# Altium project FIT_PM12.PrjPcb (part 10 of 13)

## Sheet XC2C128.SchDoc: FIT_PM12 board
size 420 x 297 mm; CheckedBy: G.Kasprowicz; Author: INR Moscow; CompanyName: WUT ISE; DrawnBy: M.Podgórski; Organization: WUT ISE; Address1: PW ISE; Address2: Nowowiejska 15/19 00-665 Warsaw; Address3: gkasprow@gmail.com; DocumentNumber: 7; Revision: 2; SheetNumber: 10; SheetTotal: 34; ModifiedBy: -; CheckedDate: -; Title2: CPLD; DivGrp: WUT ISE; Designer: INR RAS; ModifiedDate: -; ProjectName: Sensor Box
Used 12 times, as channels AFE/CPLD1, AFE/CPLD2, AFE/CPLD3, AFE/CPLD4, AFE/CPLD5, AFE/CPLD6, AFE/CPLD7, AFE/CPLD8, AFE/CPLD9, AFE/CPLD10, AFE/CPLD11, AFE/CPLD12. Parts and nets are listed once, with the designators drawn on the sheet.
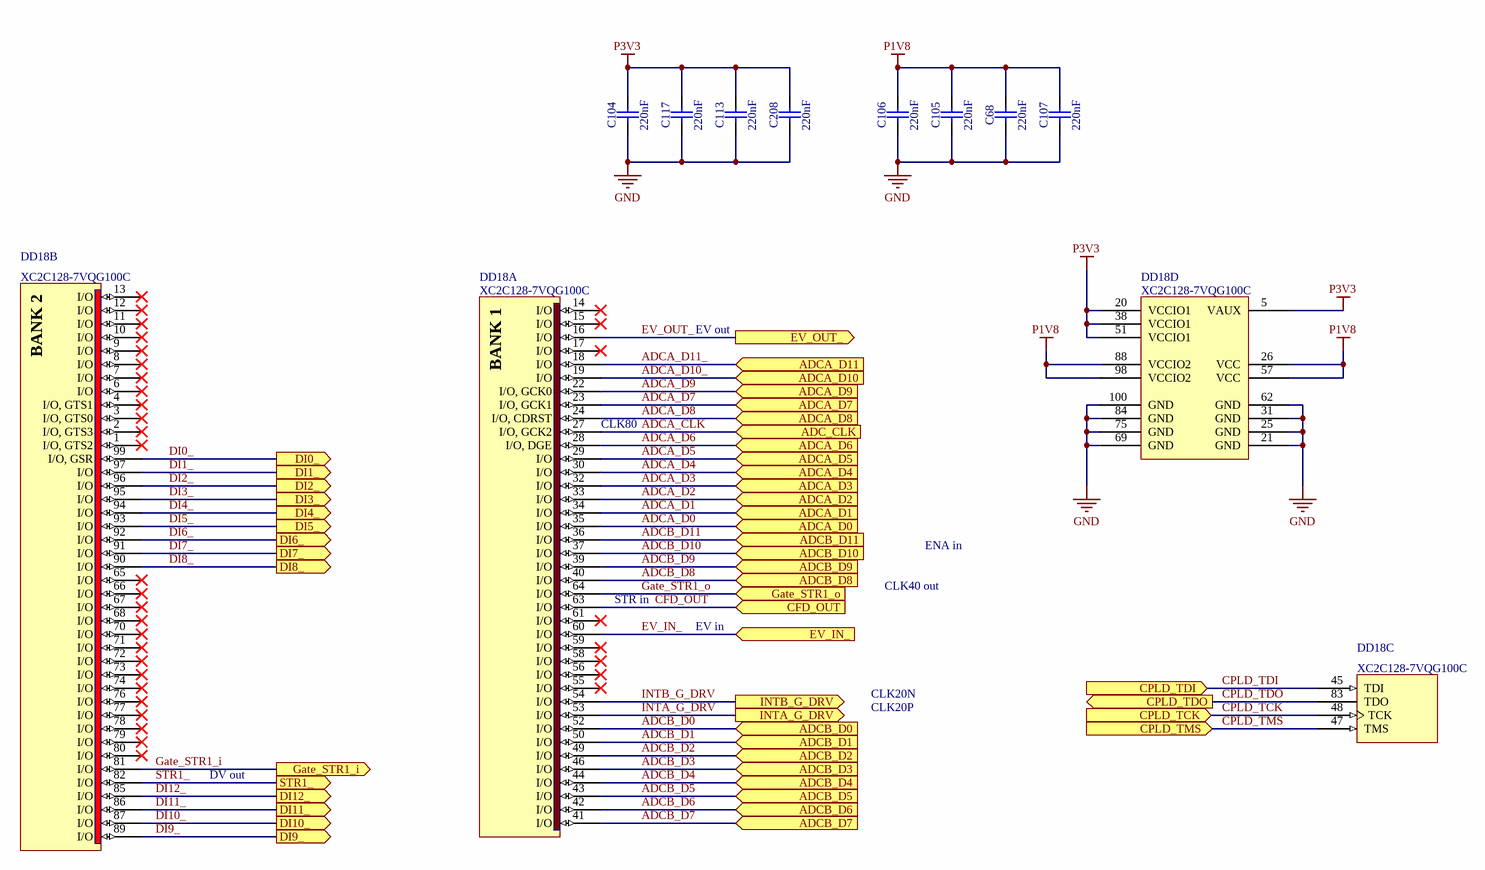
[diagram p30: XC2C128.SchDoc]

### Parts
C68  220nF  [CAPC2012X135N]
C104  220nF  [CAPC2012X135N]
C105  220nF  [CAPC2012X135N]
C106  220nF  [CAPC2012X135N]
C107  220nF  [CAPC2012X135N]
C113  220nF  [CAPC2012X135N]
C117  220nF  [CAPC2012X135N]
C208  220nF  [CAPC2012X135N]
DD18  XC2C128-7VQG100C  [QFP50P1600X1600X120-100N]  (parts A,B,C,D of 4)

### Ports
ADC_CLK (in), ADCA_D0 (in), ADCA_D1 (in), ADCA_D2 (in), ADCA_D3 (in), ADCA_D4 (in), ADCA_D5 (in), ADCA_D6 (in), ADCA_D7 (in), ADCA_D8 (in), ADCA_D9 (in), ADCA_D10 (in), ADCA_D11 (in), ADCB_D0 (in), ADCB_D1 (in), ADCB_D2 (in), ADCB_D3 (in), ADCB_D4 (in), ADCB_D5 (in), ADCB_D6 (in), ADCB_D7 (in), ADCB_D8 (in), ADCB_D9 (in), ADCB_D10 (in), ADCB_D11 (in), CFD_OUT (in), CPLD_TCK (in), CPLD_TDI (in), CPLD_TDO (out), CPLD_TMS (in), DI0_ (out), DI1_ (out), DI2_ (out), DI3_ (out), DI4_ (out), DI5_ (out), DI6_ (out), DI7_ (out), DI8_ (out), DI9_ (out), DI10_ (out), DI11_ (out), DI12_ (out), EV_IN_ (in), EV_OUT_ (out), Gate_STR1_i (out), Gate_STR1_o (in), INTA_G_DRV (out), INTB_G_DRV (out), STR1_ (out)

### Nets
GND: C68.1 C104.1 C105.1 C106.1 C107.1 C113.1 C117.1 C208.1 DD18.21(GND) DD18.25(GND) DD18.31(GND) DD18.62(GND) DD18.69(GND) DD18.75(GND) DD18.84(GND) DD18.100(GND)
P1V8: C68.2 C105.2 C106.2 C107.2 DD18.26(VCC) DD18.57(VCC) DD18.88(VCCIO2) DD18.98(VCCIO2)
P3V3: C104.2 C113.2 C117.2 C208.2 DD18.5(VAUX) DD18.20(VCCIO1) DD18.38(VCCIO1) DD18.51(VCCIO1)
ADCA_CLK: DD18.27(I/O,_GCK2) ; port ADC_CLK
ADCA_D0: DD18.35(I/O) ; port ADCA_D0
ADCA_D1: DD18.34(I/O) ; port ADCA_D1
ADCA_D2: DD18.33(I/O) ; port ADCA_D2
ADCA_D3: DD18.32(I/O) ; port ADCA_D3
ADCA_D4: DD18.30(I/O) ; port ADCA_D4
ADCA_D5: DD18.29(I/O) ; port ADCA_D5
ADCA_D6: DD18.28(I/O,_DGE) ; port ADCA_D6
ADCA_D7: DD18.23(I/O,_GCK1) ; port ADCA_D7
ADCA_D8: DD18.24(I/O,_CDRST) ; port ADCA_D8
ADCA_D9: DD18.22(I/O,_GCK0) ; port ADCA_D9
ADCA_D10_: DD18.19(I/O) ; port ADCA_D10
ADCA_D11_: DD18.18(I/O) ; port ADCA_D11
ADCB_D0: DD18.52(I/O) ; port ADCB_D0
ADCB_D1: DD18.50(I/O) ; port ADCB_D1
ADCB_D2: DD18.49(I/O) ; port ADCB_D2
ADCB_D3: DD18.46(I/O) ; port ADCB_D3
ADCB_D4: DD18.44(I/O) ; port ADCB_D4
ADCB_D5: DD18.43(I/O) ; port ADCB_D5
ADCB_D6: DD18.42(I/O) ; port ADCB_D6
ADCB_D7: DD18.41(I/O) ; port ADCB_D7
ADCB_D8: DD18.40(I/O) ; port ADCB_D8
ADCB_D9: DD18.39(I/O) ; port ADCB_D9
ADCB_D10: DD18.37(I/O) ; port ADCB_D10
ADCB_D11: DD18.36(I/O) ; port ADCB_D11
CFD_OUT: DD18.63(I/O) ; port CFD_OUT
CPLD_TCK: DD18.48(TCK) ; port CPLD_TCK
CPLD_TDI: DD18.45(TDI) ; port CPLD_TDI
CPLD_TDO: DD18.83(TDO) ; port CPLD_TDO
CPLD_TMS: DD18.47(TMS) ; port CPLD_TMS
DI0_: DD18.99(I/O,_GSR) ; port DI0_
DI1_: DD18.97(I/O) ; port DI1_
DI2_: DD18.96(I/O) ; port DI2_
DI3_: DD18.95(I/O) ; port DI3_
DI4_: DD18.94(I/O) ; port DI4_
DI5_: DD18.93(I/O) ; port DI5_
DI6_: DD18.92(I/O) ; port DI6_
DI7_: DD18.91(I/O) ; port DI7_
DI8_: DD18.90(I/O) ; port DI8_
DI9_: DD18.89(I/O) ; port DI9_
DI10_: DD18.87(I/O) ; port DI10_
DI11_: DD18.86(I/O) ; port DI11_
DI12_: DD18.85(I/O) ; port DI12_
EV_IN_: DD18.60(I/O) ; port EV_IN_
EV_OUT_: DD18.16(I/O) ; port EV_OUT_
Gate_STR1_i: DD18.81(I/O) ; port Gate_STR1_i
Gate_STR1_o: DD18.64(I/O) ; port Gate_STR1_o
INTA_G_DRV: DD18.53(I/O) ; port INTA_G_DRV
INTB_G_DRV: DD18.54(I/O) ; port INTB_G_DRV
STR1_: DD18.82(I/O) ; port STR1_

Not connected (* = marked no-connect by the designer): DD18 1(I/O,_GTS2)* 2(I/O,_GTS3)* 3(I/O,_GTS0)* 4(I/O,_GTS1)* 6(I/O)* 7(I/O)* 8(I/O)* 9(I/O)* 10(I/O)* 11(I/O)* 12(I/O)* 13(I/O)* 14(I/O)* 15(I/O)* 17(I/O)* 55(I/O)* 56(I/O)* 58(I/O)* 59(I/O)* 61(I/O)* 65(I/O)* 66(I/O)* 67(I/O)* 68(I/O)* 70(I/O)* 71(I/O)* 72(I/O)* 73(I/O)* 74(I/O)* 76(I/O)* 77(I/O)* 78(I/O)* 79(I/O)* 80(I/O)*

### Channels
AFE/CPLD1: designators end in A; ports ADC_CLK=ADC_CLK ADCA_D0=ADCA_D0 ADCA_D1=ADCA_D1 ADCA_D2=ADCA_D2 ADCA_D3=ADCA_D3 ADCA_D4=ADCA_D4 ADCA_D5=ADCA_D5 ADCA_D6=ADCA_D6 ADCA_D7=ADCA_D7 ADCA_D8=ADCA_D8 ADCA_D9=ADCA_D9 ADCA_D10=ADCA_D10_ ADCA_D11=ADCA_D11_ ADCB_D0=ADCB_D0 ADCB_D1=ADCB_D1 ADCB_D2=ADCB_D2 ADCB_D3=ADCB_D3 ADCB_D4=ADCB_D4 ADCB_D5=ADCB_D5 ADCB_D6=ADCB_D6 ADCB_D7=ADCB_D7 ADCB_D8=ADCB_D8 ADCB_D9=ADCB_D9 ADCB_D10=ADCB_D10 ADCB_D11=ADCB_D11 CFD_OUT=CFD_OUT CPLD_TCK=CPLD_TCK CPLD_TDI=CPLD_TDI CPLD_TDO=CPLD_TDI CPLD_TMS=CPLD_TMS DI0_=DI0_ DI1_=DI1_ DI2_=DI2_ DI3_=DI3_ DI4_=DI4_ DI5_=DI5_ DI6_=DI6_ DI7_=DI7_ DI8_=DI8_ DI9_=DI9_ DI10_=DI10_ DI11_=DI11_ DI12_=DI12_ EV_IN_=EV_IN_ EV_OUT_=EV_OUT__CPLD1 Gate_STR1_i=Gate_STR1_i Gate_STR1_o=Gate_STR1_o INTA_G_DRV=INTA_G_DRV INTB_G_DRV=INTB_G_DRV STR1_=STR1_
AFE/CPLD2: designators end in B; ports ADC_CLK=ADC_CLK ADCA_D0=ADCA_D0 ADCA_D1=ADCA_D1 ADCA_D2=ADCA_D2 ADCA_D3=ADCA_D3 ADCA_D4=ADCA_D4 ADCA_D5=ADCA_D5 ADCA_D6=ADCA_D6 ADCA_D7=ADCA_D7 ADCA_D8=ADCA_D8 ADCA_D9=ADCA_D9 ADCA_D10=ADCA_D10_ ADCA_D11=ADCA_D11_ ADCB_D0=ADCB_D0 ADCB_D1=ADCB_D1 ADCB_D2=ADCB_D2 ADCB_D3=ADCB_D3 ADCB_D4=ADCB_D4 ADCB_D5=ADCB_D5 ADCB_D6=ADCB_D6 ADCB_D7=ADCB_D7 ADCB_D8=ADCB_D8 ADCB_D9=ADCB_D9 ADCB_D10=ADCB_D10 ADCB_D11=ADCB_D11 CFD_OUT=CFD_OUT CPLD_TCK=CPLD_TCK CPLD_TDI=CPLD_TDI CPLD_TDO=CPLD_TDI CPLD_TMS=CPLD_TMS DI0_=DI0_ DI1_=DI1_ DI2_=DI2_ DI3_=DI3_ DI4_=DI4_ DI5_=DI5_ DI6_=DI6_ DI7_=DI7_ DI8_=DI8_ DI9_=DI9_ DI10_=DI10_ DI11_=DI11_ DI12_=DI12_ EV_IN_=EV_IN_ EV_OUT_=EV_IN_ Gate_STR1_i=Gate_STR1_i Gate_STR1_o=Gate_STR1_o INTA_G_DRV=INTA_G_DRV INTB_G_DRV=INTB_G_DRV STR1_=STR1_
AFE/CPLD3: designators end in C; ports ADC_CLK=ADC_CLK ADCA_D0=ADCA_D0 ADCA_D1=ADCA_D1 ADCA_D2=ADCA_D2 ADCA_D3=ADCA_D3 ADCA_D4=ADCA_D4 ADCA_D5=ADCA_D5 ADCA_D6=ADCA_D6 ADCA_D7=ADCA_D7 ADCA_D8=ADCA_D8 ADCA_D9=ADCA_D9 ADCA_D10=ADCA_D10_ ADCA_D11=ADCA_D11_ ADCB_D0=ADCB_D0 ADCB_D1=ADCB_D1 ADCB_D2=ADCB_D2 ADCB_D3=ADCB_D3 ADCB_D4=ADCB_D4 ADCB_D5=ADCB_D5 ADCB_D6=ADCB_D6 ADCB_D7=ADCB_D7 ADCB_D8=ADCB_D8 ADCB_D9=ADCB_D9 ADCB_D10=ADCB_D10 ADCB_D11=ADCB_D11 CFD_OUT=CFD_OUT CPLD_TCK=CPLD_TCK CPLD_TDI=CPLD_TDI CPLD_TDO=CPLD_TDI CPLD_TMS=CPLD_TMS DI0_=DI0_ DI1_=DI1_ DI2_=DI2_ DI3_=DI3_ DI4_=DI4_ DI5_=DI5_ DI6_=DI6_ DI7_=DI7_ DI8_=DI8_ DI9_=DI9_ DI10_=DI10_ DI11_=DI11_ DI12_=DI12_ EV_IN_=EV_IN_ EV_OUT_=EV_IN_ Gate_STR1_i=Gate_STR1_i Gate_STR1_o=Gate_STR1_o INTA_G_DRV=INTA_G_DRV INTB_G_DRV=INTB_G_DRV STR1_=STR1_
AFE/CPLD4: designators end in D; ports ADC_CLK=ADC_CLK ADCA_D0=ADCA_D0 ADCA_D1=ADCA_D1 ADCA_D2=ADCA_D2 ADCA_D3=ADCA_D3 ADCA_D4=ADCA_D4 ADCA_D5=ADCA_D5 ADCA_D6=ADCA_D6 ADCA_D7=ADCA_D7 ADCA_D8=ADCA_D8 ADCA_D9=ADCA_D9 ADCA_D10=ADCA_D10_ ADCA_D11=ADCA_D11_ ADCB_D0=ADCB_D0 ADCB_D1=ADCB_D1 ADCB_D2=ADCB_D2 ADCB_D3=ADCB_D3 ADCB_D4=ADCB_D4 ADCB_D5=ADCB_D5 ADCB_D6=ADCB_D6 ADCB_D7=ADCB_D7 ADCB_D8=ADCB_D8 ADCB_D9=ADCB_D9 ADCB_D10=ADCB_D10 ADCB_D11=ADCB_D11 CFD_OUT=CFD_OUT CPLD_TCK=CPLD_TCK CPLD_TDI=CPLD_TDI CPLD_TDO=CPLD_TDI CPLD_TMS=CPLD_TMS DI0_=DI0_ DI1_=DI1_ DI2_=DI2_ DI3_=DI3_ DI4_=DI4_ DI5_=DI5_ DI6_=DI6_ DI7_=DI7_ DI8_=DI8_ DI9_=DI9_ DI10_=DI10_ DI11_=DI11_ DI12_=DI12_ EV_IN_=EV_IN_ EV_OUT_=EV_IN_ Gate_STR1_i=Gate_STR1_i Gate_STR1_o=Gate_STR1_o INTA_G_DRV=INTA_G_DRV INTB_G_DRV=INTB_G_DRV STR1_=STR1_
AFE/CPLD5: designators end in E; ports ADC_CLK=ADC_CLK ADCA_D0=ADCA_D0 ADCA_D1=ADCA_D1 ADCA_D2=ADCA_D2 ADCA_D3=ADCA_D3 ADCA_D4=ADCA_D4 ADCA_D5=ADCA_D5 ADCA_D6=ADCA_D6 ADCA_D7=ADCA_D7 ADCA_D8=ADCA_D8 ADCA_D9=ADCA_D9 ADCA_D10=ADCA_D10_ ADCA_D11=ADCA_D11_ ADCB_D0=ADCB_D0 ADCB_D1=ADCB_D1 ADCB_D2=ADCB_D2 ADCB_D3=ADCB_D3 ADCB_D4=ADCB_D4 ADCB_D5=ADCB_D5 ADCB_D6=ADCB_D6 ADCB_D7=ADCB_D7 ADCB_D8=ADCB_D8 ADCB_D9=ADCB_D9 ADCB_D10=ADCB_D10 ADCB_D11=ADCB_D11 CFD_OUT=CFD_OUT CPLD_TCK=CPLD_TCK CPLD_TDI=CPLD_TDI CPLD_TDO=CPLD_TDI CPLD_TMS=CPLD_TMS DI0_=DI0_ DI1_=DI1_ DI2_=DI2_ DI3_=DI3_ DI4_=DI4_ DI5_=DI5_ DI6_=DI6_ DI7_=DI7_ DI8_=DI8_ DI9_=DI9_ DI10_=DI10_ DI11_=DI11_ DI12_=DI12_ EV_IN_=EV_IN_ EV_OUT_=EV_IN_ Gate_STR1_i=Gate_STR1_i Gate_STR1_o=Gate_STR1_o INTA_G_DRV=INTA_G_DRV INTB_G_DRV=INTB_G_DRV STR1_=STR1_
AFE/CPLD6: designators end in F; ports ADC_CLK=ADC_CLK ADCA_D0=ADCA_D0 ADCA_D1=ADCA_D1 ADCA_D2=ADCA_D2 ADCA_D3=ADCA_D3 ADCA_D4=ADCA_D4 ADCA_D5=ADCA_D5 ADCA_D6=ADCA_D6 ADCA_D7=ADCA_D7 ADCA_D8=ADCA_D8 ADCA_D9=ADCA_D9 ADCA_D10=ADCA_D10_ ADCA_D11=ADCA_D11_ ADCB_D0=ADCB_D0 ADCB_D1=ADCB_D1 ADCB_D2=ADCB_D2 ADCB_D3=ADCB_D3 ADCB_D4=ADCB_D4 ADCB_D5=ADCB_D5 ADCB_D6=ADCB_D6 ADCB_D7=ADCB_D7 ADCB_D8=ADCB_D8 ADCB_D9=ADCB_D9 ADCB_D10=ADCB_D10 ADCB_D11=ADCB_D11 CFD_OUT=CFD_OUT CPLD_TCK=CPLD_TCK CPLD_TDI=CPLD_TDI CPLD_TDO=CPLD_TDI CPLD_TMS=CPLD_TMS DI0_=DI0_ DI1_=DI1_ DI2_=DI2_ DI3_=DI3_ DI4_=DI4_ DI5_=DI5_ DI6_=DI6_ DI7_=DI7_ DI8_=DI8_ DI9_=DI9_ DI10_=DI10_ DI11_=DI11_ DI12_=DI12_ EV_IN_=EV_IN_ EV_OUT_=EV_IN_ Gate_STR1_i=Gate_STR1_i Gate_STR1_o=Gate_STR1_o INTA_G_DRV=INTA_G_DRV INTB_G_DRV=INTB_G_DRV STR1_=STR1_
AFE/CPLD7: designators end in G; ports ADC_CLK=ADC_CLK ADCA_D0=ADCA_D0 ADCA_D1=ADCA_D1 ADCA_D2=ADCA_D2 ADCA_D3=ADCA_D3 ADCA_D4=ADCA_D4 ADCA_D5=ADCA_D5 ADCA_D6=ADCA_D6 ADCA_D7=ADCA_D7 ADCA_D8=ADCA_D8 ADCA_D9=ADCA_D9 ADCA_D10=ADCA_D10_ ADCA_D11=ADCA_D11_ ADCB_D0=ADCB_D0 ADCB_D1=ADCB_D1 ADCB_D2=ADCB_D2 ADCB_D3=ADCB_D3 ADCB_D4=ADCB_D4 ADCB_D5=ADCB_D5 ADCB_D6=ADCB_D6 ADCB_D7=ADCB_D7 ADCB_D8=ADCB_D8 ADCB_D9=ADCB_D9 ADCB_D10=ADCB_D10 ADCB_D11=ADCB_D11 CFD_OUT=CFD_OUT CPLD_TCK=CPLD_TCK CPLD_TDI=CPLD_TDI CPLD_TDO=CPLD_TDI CPLD_TMS=CPLD_TMS DI0_=DI0_ DI1_=DI1_ DI2_=DI2_ DI3_=DI3_ DI4_=DI4_ DI5_=DI5_ DI6_=DI6_ DI7_=DI7_ DI8_=DI8_ DI9_=DI9_ DI10_=DI10_ DI11_=DI11_ DI12_=DI12_ EV_IN_=EV_IN_ EV_OUT_=EV_IN_ Gate_STR1_i=Gate_STR1_i Gate_STR1_o=Gate_STR1_o INTA_G_DRV=INTA_G_DRV INTB_G_DRV=INTB_G_DRV STR1_=STR1_
AFE/CPLD8: designators end in H; ports ADC_CLK=ADC_CLK ADCA_D0=ADCA_D0 ADCA_D1=ADCA_D1 ADCA_D2=ADCA_D2 ADCA_D3=ADCA_D3 ADCA_D4=ADCA_D4 ADCA_D5=ADCA_D5 ADCA_D6=ADCA_D6 ADCA_D7=ADCA_D7 ADCA_D8=ADCA_D8 ADCA_D9=ADCA_D9 ADCA_D10=ADCA_D10_ ADCA_D11=ADCA_D11_ ADCB_D0=ADCB_D0 ADCB_D1=ADCB_D1 ADCB_D2=ADCB_D2 ADCB_D3=ADCB_D3 ADCB_D4=ADCB_D4 ADCB_D5=ADCB_D5 ADCB_D6=ADCB_D6 ADCB_D7=ADCB_D7 ADCB_D8=ADCB_D8 ADCB_D9=ADCB_D9 ADCB_D10=ADCB_D10 ADCB_D11=ADCB_D11 CFD_OUT=CFD_OUT CPLD_TCK=CPLD_TCK CPLD_TDI=CPLD_TDI CPLD_TDO=CPLD_TDI CPLD_TMS=CPLD_TMS DI0_=DI0_ DI1_=DI1_ DI2_=DI2_ DI3_=DI3_ DI4_=DI4_ DI5_=DI5_ DI6_=DI6_ DI7_=DI7_ DI8_=DI8_ DI9_=DI9_ DI10_=DI10_ DI11_=DI11_ DI12_=DI12_ EV_IN_=EV_IN_ EV_OUT_=EV_IN_ Gate_STR1_i=Gate_STR1_i Gate_STR1_o=Gate_STR1_o INTA_G_DRV=INTA_G_DRV INTB_G_DRV=INTB_G_DRV STR1_=STR1_
AFE/CPLD9: designators end in I; ports ADC_CLK=ADC_CLK ADCA_D0=ADCA_D0 ADCA_D1=ADCA_D1 ADCA_D2=ADCA_D2 ADCA_D3=ADCA_D3 ADCA_D4=ADCA_D4 ADCA_D5=ADCA_D5 ADCA_D6=ADCA_D6 ADCA_D7=ADCA_D7 ADCA_D8=ADCA_D8 ADCA_D9=ADCA_D9 ADCA_D10=ADCA_D10_ ADCA_D11=ADCA_D11_ ADCB_D0=ADCB_D0 ADCB_D1=ADCB_D1 ADCB_D2=ADCB_D2 ADCB_D3=ADCB_D3 ADCB_D4=ADCB_D4 ADCB_D5=ADCB_D5 ADCB_D6=ADCB_D6 ADCB_D7=ADCB_D7 ADCB_D8=ADCB_D8 ADCB_D9=ADCB_D9 ADCB_D10=ADCB_D10 ADCB_D11=ADCB_D11 CFD_OUT=CFD_OUT CPLD_TCK=CPLD_TCK CPLD_TDI=CPLD_TDI CPLD_TDO=CPLD_TDI CPLD_TMS=CPLD_TMS DI0_=DI0_ DI1_=DI1_ DI2_=DI2_ DI3_=DI3_ DI4_=DI4_ DI5_=DI5_ DI6_=DI6_ DI7_=DI7_ DI8_=DI8_ DI9_=DI9_ DI10_=DI10_ DI11_=DI11_ DI12_=DI12_ EV_IN_=EV_IN_ EV_OUT_=EV_IN_ Gate_STR1_i=Gate_STR1_i Gate_STR1_o=Gate_STR1_o INTA_G_DRV=INTA_G_DRV INTB_G_DRV=INTB_G_DRV STR1_=STR1_
AFE/CPLD10: designators end in J; ports ADC_CLK=ADC_CLK ADCA_D0=ADCA_D0 ADCA_D1=ADCA_D1 ADCA_D2=ADCA_D2 ADCA_D3=ADCA_D3 ADCA_D4=ADCA_D4 ADCA_D5=ADCA_D5 ADCA_D6=ADCA_D6 ADCA_D7=ADCA_D7 ADCA_D8=ADCA_D8 ADCA_D9=ADCA_D9 ADCA_D10=ADCA_D10_ ADCA_D11=ADCA_D11_ ADCB_D0=ADCB_D0 ADCB_D1=ADCB_D1 ADCB_D2=ADCB_D2 ADCB_D3=ADCB_D3 ADCB_D4=ADCB_D4 ADCB_D5=ADCB_D5 ADCB_D6=ADCB_D6 ADCB_D7=ADCB_D7 ADCB_D8=ADCB_D8 ADCB_D9=ADCB_D9 ADCB_D10=ADCB_D10 ADCB_D11=ADCB_D11 CFD_OUT=CFD_OUT CPLD_TCK=CPLD_TCK CPLD_TDI=CPLD_TDI CPLD_TDO=CPLD_TDI CPLD_TMS=CPLD_TMS DI0_=DI0_ DI1_=DI1_ DI2_=DI2_ DI3_=DI3_ DI4_=DI4_ DI5_=DI5_ DI6_=DI6_ DI7_=DI7_ DI8_=DI8_ DI9_=DI9_ DI10_=DI10_ DI11_=DI11_ DI12_=DI12_ EV_IN_=EV_IN_ EV_OUT_=EV_IN_ Gate_STR1_i=Gate_STR1_i Gate_STR1_o=Gate_STR1_o INTA_G_DRV=INTA_G_DRV INTB_G_DRV=INTB_G_DRV STR1_=STR1_
AFE/CPLD11: designators end in K; ports ADC_CLK=ADC_CLK ADCA_D0=ADCA_D0 ADCA_D1=ADCA_D1 ADCA_D2=ADCA_D2 ADCA_D3=ADCA_D3 ADCA_D4=ADCA_D4 ADCA_D5=ADCA_D5 ADCA_D6=ADCA_D6 ADCA_D7=ADCA_D7 ADCA_D8=ADCA_D8 ADCA_D9=ADCA_D9 ADCA_D10=ADCA_D10_ ADCA_D11=ADCA_D11_ ADCB_D0=ADCB_D0 ADCB_D1=ADCB_D1 ADCB_D2=ADCB_D2 ADCB_D3=ADCB_D3 ADCB_D4=ADCB_D4 ADCB_D5=ADCB_D5 ADCB_D6=ADCB_D6 ADCB_D7=ADCB_D7 ADCB_D8=ADCB_D8 ADCB_D9=ADCB_D9 ADCB_D10=ADCB_D10 ADCB_D11=ADCB_D11 CFD_OUT=CFD_OUT CPLD_TCK=CPLD_TCK CPLD_TDI=CPLD_TDI CPLD_TDO=CPLD_TDI CPLD_TMS=CPLD_TMS DI0_=DI0_ DI1_=DI1_ DI2_=DI2_ DI3_=DI3_ DI4_=DI4_ DI5_=DI5_ DI6_=DI6_ DI7_=DI7_ DI8_=DI8_ DI9_=DI9_ DI10_=DI10_ DI11_=DI11_ DI12_=DI12_ EV_IN_=EV_IN_ EV_OUT_=EV_IN_ Gate_STR1_i=Gate_STR1_i Gate_STR1_o=Gate_STR1_o INTA_G_DRV=INTA_G_DRV INTB_G_DRV=INTB_G_DRV STR1_=STR1_
AFE/CPLD12: designators end in L; ports ADC_CLK=ADC_CLK ADCA_D0=ADCA_D0 ADCA_D1=ADCA_D1 ADCA_D2=ADCA_D2 ADCA_D3=ADCA_D3 ADCA_D4=ADCA_D4 ADCA_D5=ADCA_D5 ADCA_D6=ADCA_D6 ADCA_D7=ADCA_D7 ADCA_D8=ADCA_D8 ADCA_D9=ADCA_D9 ADCA_D10=ADCA_D10_ ADCA_D11=ADCA_D11_ ADCB_D0=ADCB_D0 ADCB_D1=ADCB_D1 ADCB_D2=ADCB_D2 ADCB_D3=ADCB_D3 ADCB_D4=ADCB_D4 ADCB_D5=ADCB_D5 ADCB_D6=ADCB_D6 ADCB_D7=ADCB_D7 ADCB_D8=ADCB_D8 ADCB_D9=ADCB_D9 ADCB_D10=ADCB_D10 ADCB_D11=ADCB_D11 CFD_OUT=CFD_OUT CPLD_TCK=CPLD_TCK CPLD_TDI=CPLD_TDI CPLD_TDO=CPLD_TDO CPLD_TMS=CPLD_TMS DI0_=DI0_ DI1_=DI1_ DI2_=DI2_ DI3_=DI3_ DI4_=DI4_ DI5_=DI5_ DI6_=DI6_ DI7_=DI7_ DI8_=DI8_ DI9_=DI9_ DI10_=DI10_ DI11_=DI11_ DI12_=DI12_ EV_IN_=EV_IN_ EV_OUT_=EV_IN_ Gate_STR1_i=Gate_STR1_i Gate_STR1_o=Gate_STR1_o INTA_G_DRV=INTA_G_DRV INTB_G_DRV=INTB_G_DRV STR1_=STR1_

### Notes on the sheet
- EV out
- (near DD18) CLK80
- ENA in
- STR in
- EV in
- CLK40 out
- CLK20N
- DV out
- CLK20P
- Project/Equipment
- Document
- Designer
- Drawn by
- Check.by
- Copyright WUT ISE 2024.
  This documentation describes Open Hardware and is licensed under the CERN OHL v.2. You may redistribute and modify this documentation under the terms of the CERN OHL v.2. (http://ohwr.org/CERNOHL). This documentation is distributed WITHOUT ANY EXPRESS OR IMPLIED WARRANTY, INCLUDING OF MERCHANTABILITY, SATISFACTORY QUALITY AND FITNESS FOR A PARTICULAR PURPOSE. Please see the CERN OHL v.2 for applicable conditions.
- Contact
- File
- Last Mod.
- Print Date
- Sheet
- Size
- A3
- of
- Rev
- (in symbol XC2C128-7VQG100C, part A) BANK 1
- (in symbol XC2C128-7VQG100C, part B) BANK 2

### Library data of the parts
C68 C104-C107 C113 C117 C208 = CC0805_220NF_50V_10%_X7R: Non-polarised capacitor; Part Description: SMD Multilayer Chip Ceramic Capacitor; Manufacturer: GENERIC; Manufacturer1 Part Number: GRM21BR71H224KA01L; Voltage: 50V; TC: X7R; Tolerance: ±10%; Part Number: CC0805_220NF_50V_10%_X7R; Component Kind: Standard; Component Type: Standard; Pin Count: 2; Value: 220nF; Status: Preferred; Manufacturer Part Number: CC0805_220NF_50V_10%_X7R; Case: 0805; Mounted: Yes; Socket: No; SMD: Yes; Sense: No; Manufacturer1 Example: MURATA; Manufacturer1 ComponentHeight: 1.35mm; HelpURL: \\cern.ch\dfs\Applications\Altium\Datasheets\CC0805_X7R_MURATA.pdf; Author: CERN DEM JLC; CreateDate: 03.12.2007; LatestRevisionDate: 03.12.2007
DD18 = XC2C128-7VQG100C: CoolRunner-II 1.8V, 128 Macrocell CPLD, 80 User I/Os, 100-Pin VQFP, Commercial Grade, Pb-Free; Manufacturer: XILINX; PressFit: No; Bonding: No; Part Number: XC2C128-7VQG100C; Component Kind: Standard; Component Type: Standard; Device: XC2C128-7VQG100C; PackageDescription: QFP, 0.50mm Pitch, Square; 100 pin, 14.0mm L X 14.0mm W X 1.20mm H body, IPC Medium Density; Part Description: CoolRunner-II 1.8V, 128 Macrocell CPLD, 80 User I/Os, 100-Pin VQFP, Commercial Grade, Pb-Free; Manufacturer Part Number: XC2C128-7VQG100C; Pin Count: 100; Case: QFP100; Mounted: Yes; Socket: No; SMD: Yes; Sense: No; ComponentHeight: 1.2mm; HelpURL: \\cern.ch\dfs\Applications\Altium\Datasheets\XC2C128-7VQG100C.pdf; ComponentLink1URL: \\cern.ch\dfs\Applications\Altium\Datasheets\XC2C128-7VQG100C_Package.pdf; ComponentLink1Description: Package Drawing; Author: CERN DEM MR; CreateDate: 15.12.2015; LatestRevisionDate: 15.12.2015

## Sheet DAC8554.SchDoc: FIT_PM12 board
size 420 x 297 mm; CheckedBy: G.Kasprowicz; Author: INR Moscow; CompanyName: WUT ISE; DrawnBy: M.Podgórski; Organization: WUT ISE; Address1: PW ISE; Address2: Nowowiejska 15/19 00-665 Warsaw; Address3: gkasprow@gmail.com; DocumentNumber: 8; Revision: 2; SheetNumber: 11; SheetTotal: 34; ModifiedBy: -; CheckedDate: -; Title2: DACs; DivGrp: WUT ISE; Designer: INR RAS; ModifiedDate: -; ProjectName: Sensor Box
Used 12 times, as channels AFE/QDC1, AFE/QDC2, AFE/QDC3, AFE/QDC4, AFE/QDC5, AFE/QDC6, AFE/QDC7, AFE/QDC8, AFE/QDC9, AFE/QDC10, AFE/QDC11, AFE/QDC12. Parts and nets are listed once, with the designators drawn on the sheet.
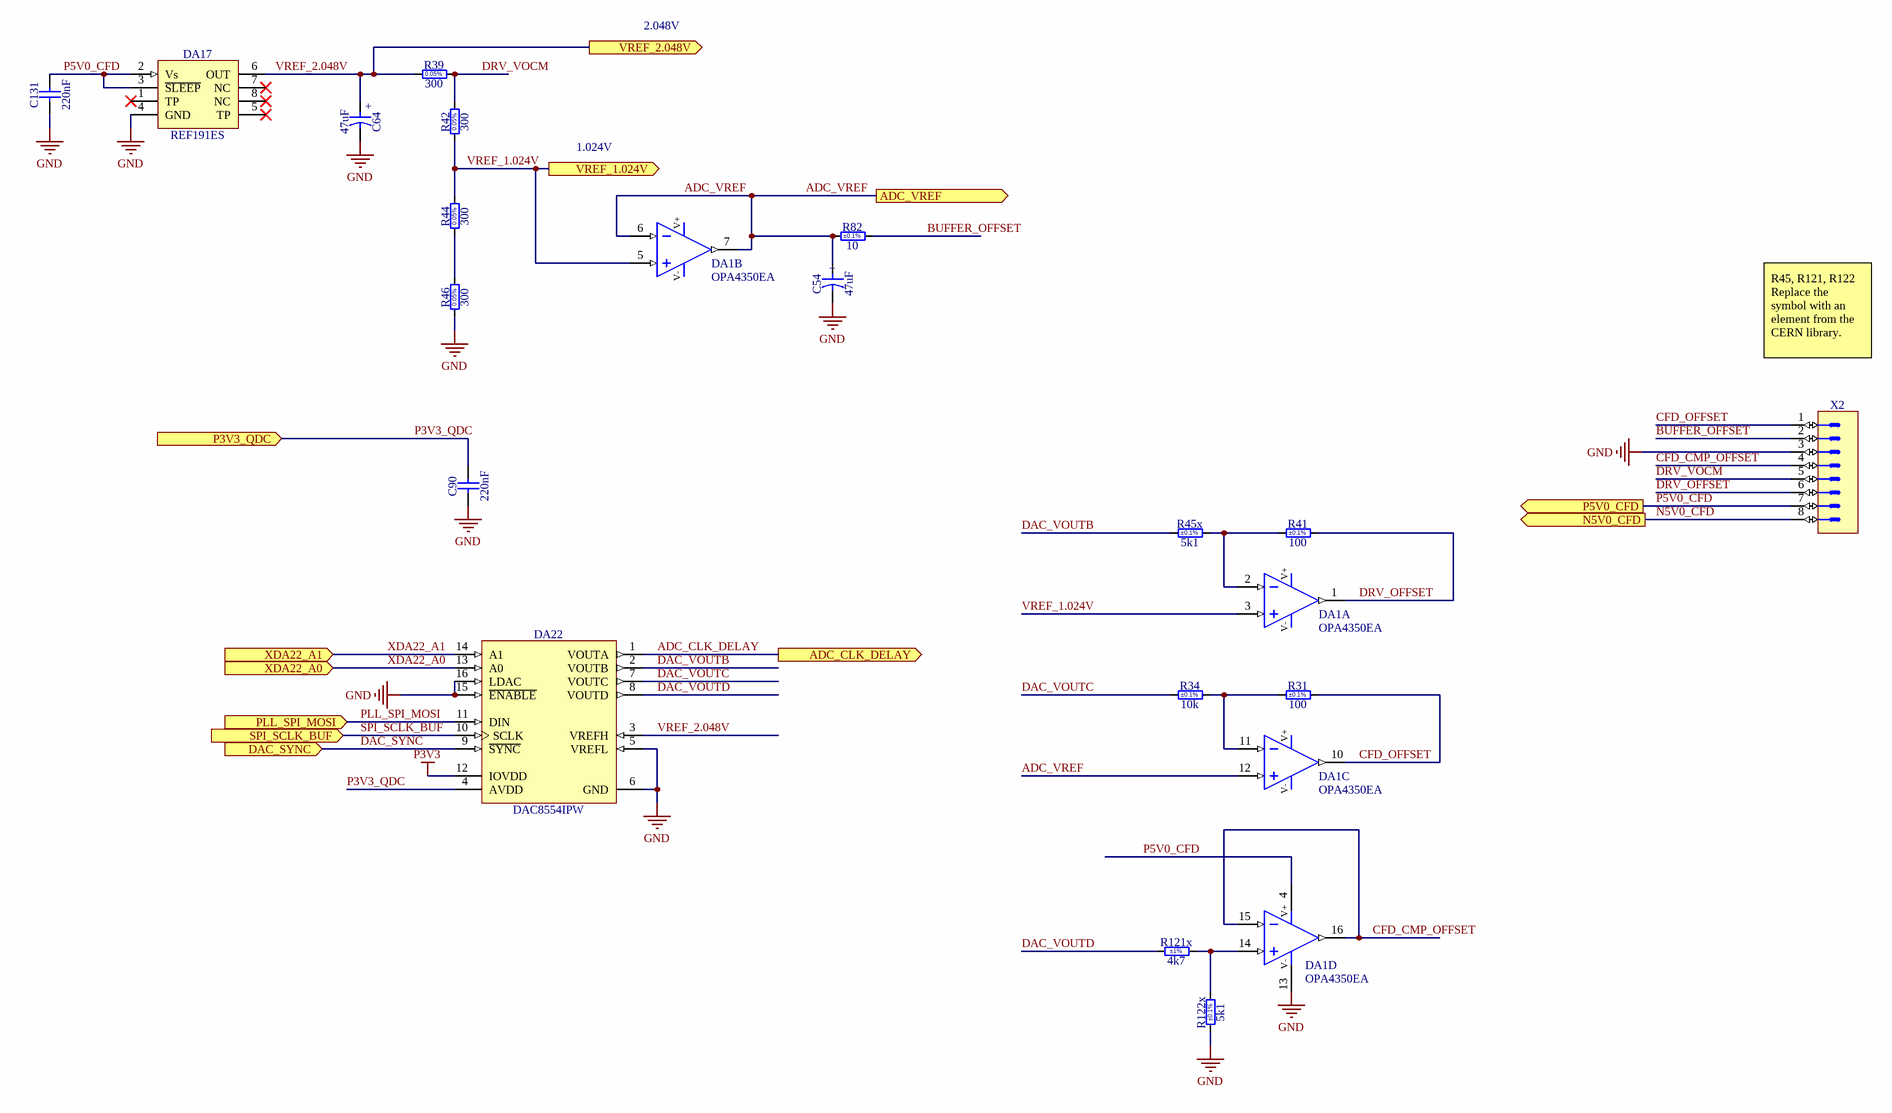
[diagram p31: DAC8554.SchDoc]

### Parts
C54  47uF  [CAPMP3528X120N]
C64  47uF  [CAPMP3528X120N]
C90  220nF  [CAPC2012X135N]
C131  220nF  [CAPC2012X135N]
DA1  OPA4350EA  [SOP63P600X175-16N]  (parts A,B,C,D of 4)
DA17  REF191ES  [SOIC127P600X175-8N]
DA22  DAC8554IPW  [SOP65P640X110-16N]
R31  100  Tolerance: ±0.1%  [RESC2012X60N]
R34  10k  Tolerance: ±0.1%  [RESC2012X60N]
R39  300  [RESC2012X60N]
R41  100  Tolerance: ±0.1%  [RESC2012X60N]
R42  300  [RESC2012X60N]
R44  300  [RESC2012X60N]
R45x  5k1  Tolerance: ±0.1%  [RESC2012X60N]
R46  300  [RESC2012X60N]
R82  10  Tolerance: ±0.1%  [RESC2012X60N]
R121x  4k7  Tolerance: ±1%  [RESC2012X60N]
R122x  5k1  Tolerance: ±0.1%  [RESC2012X60N]
X2  Header 8  [SAMTEC_DW-08-09-L-S-470]  (value not drawn)

### Ports
ADC_CLK_DELAY (out), ADC_VREF (out), DAC_SYNC (in), N5V0_CFD (out), P3V3_QDC (in), P5V0_CFD (out), PLL_SPI_MOSI (in), SPI_SCLK_BUF (in), VREF_1.024V (out), VREF_2.048V (out), XDA22_A0 (in), XDA22_A1 (in)

### Nets
GND: C54.2 C64.2 C90.1 C131.1 DA1.13(V-) DA17.4(GND) DA22.5(VREFL) DA22.6(GND) DA22.15(~{ENABLE}) DA22.16(LDAC) R46.1 R122x.1 X2.3
P3V3: DA22.12(IOVDD)
ADC_CLK_DELAY: DA22.1(VOUTA) ; port ADC_CLK_DELAY
ADC_VREF: C54.1 DA1.6(IN-) DA1.7(OUT) DA1.12(IN+) R82.2 ; port ADC_VREF
BUFFER_OFFSET: R82.1 X2.2
CFD_CMP_OFFSET: DA1.15(IN-) DA1.16(OUT) X2.4
CFD_OFFSET: DA1.10(OUT) R31.2 X2.1
DAC_SYNC: DA22.9(~{SYNC}) ; port DAC_SYNC
DAC_VOUTB: DA22.2(VOUTB) R45x.1
DAC_VOUTC: DA22.7(VOUTC) R34.1
DAC_VOUTD: DA22.8(VOUTD) R121x.1
DRV_OFFSET: DA1.1(OUT) R41.2 X2.6
DRV_VOCM: R39.2 R42.2 X2.5
N5V0_CFD: X2.8 ; port N5V0_CFD
P3V3_QDC: C90.2 DA22.4(AVDD) ; port P3V3_QDC
P5V0_CFD: C131.2 DA1.4(V+) DA17.2(Vs) DA17.3(~{SLEEP}) X2.7 ; port P5V0_CFD
PLL_SPI_MOSI: DA22.11(DIN) ; port PLL_SPI_MOSI
SPI_SCLK_BUF: DA22.10(SCLK) ; port SPI_SCLK_BUF
VREF_1.024V: DA1.3(IN+) DA1.5(IN+) R42.1 R44.2 ; port VREF_1.024V
VREF_2.048V: C64.1 DA17.6(OUT) DA22.3(VREFH) R39.1 ; port VREF_2.048V
XDA22_A0: DA22.13(A0) ; port XDA22_A0
XDA22_A1: DA22.14(A1) ; port XDA22_A1
NetDA1_2: DA1.2(IN-) R41.1 R45x.2
NetDA1_11: DA1.11(IN-) R31.1 R34.2
NetDA1_14: DA1.14(IN+) R121x.2 R122x.2
NetR44_1: R44.1 R46.2

Not connected (* = marked no-connect by the designer): DA17 1(TP)* 5(TP)* 7(NC)* 8(NC)*

### Channels
AFE/QDC1: designators end in A; ports ADC_CLK_DELAY=ADC_CLK_DELAY ADC_VREF=ADC_VREF DAC_SYNC=DAC_SYNC N5V0_CFD=N5V0_CFD P3V3_QDC=P3V3_QDC P5V0_CFD=P5V0_CFD PLL_SPI_MOSI=PLL_SPI_MOSI SPI_SCLK_BUF=SPI_SCLK_BUF VREF_1.024V=VREF_1.024V VREF_2.048V=VREF_2.048V XDA22_A0=GND XDA22_A1=GND
AFE/QDC2: designators end in B; ports ADC_CLK_DELAY=ADC_CLK_DELAY ADC_VREF=ADC_VREF DAC_SYNC=DAC_SYNC N5V0_CFD=N5V0_CFD P3V3_QDC=P3V3_QDC P5V0_CFD=P5V0_CFD PLL_SPI_MOSI=PLL_SPI_MOSI SPI_SCLK_BUF=SPI_SCLK_BUF VREF_1.024V=VREF_1.024V VREF_2.048V=VREF_2.048V XDA22_A0=P3V3 XDA22_A1=GND
AFE/QDC3: designators end in C; ports ADC_CLK_DELAY=ADC_CLK_DELAY ADC_VREF=ADC_VREF DAC_SYNC=DAC_SYNC N5V0_CFD=N5V0_CFD P3V3_QDC=P3V3_QDC P5V0_CFD=P5V0_CFD PLL_SPI_MOSI=PLL_SPI_MOSI SPI_SCLK_BUF=SPI_SCLK_BUF VREF_1.024V=VREF_1.024V VREF_2.048V=VREF_2.048V XDA22_A0=GND XDA22_A1=P3V3
AFE/QDC4: designators end in D; ports ADC_CLK_DELAY=ADC_CLK_DELAY ADC_VREF=ADC_VREF DAC_SYNC=DAC_SYNC N5V0_CFD=N5V0_CFD P3V3_QDC=P3V3_QDC P5V0_CFD=P5V0_CFD PLL_SPI_MOSI=PLL_SPI_MOSI SPI_SCLK_BUF=SPI_SCLK_BUF VREF_1.024V=VREF_1.024V VREF_2.048V=VREF_2.048V XDA22_A0=P3V3 XDA22_A1=P3V3
AFE/QDC5: designators end in E; ports ADC_CLK_DELAY=ADC_CLK_DELAY ADC_VREF=ADC_VREF DAC_SYNC=DAC_SYNC N5V0_CFD=N5V0_CFD P3V3_QDC=P3V3_QDC P5V0_CFD=P5V0_CFD PLL_SPI_MOSI=PLL_SPI_MOSI SPI_SCLK_BUF=SPI_SCLK_BUF VREF_1.024V=VREF_1.024V VREF_2.048V=VREF_2.048V XDA22_A0=GND XDA22_A1=GND
AFE/QDC6: designators end in F; ports ADC_CLK_DELAY=ADC_CLK_DELAY ADC_VREF=ADC_VREF DAC_SYNC=DAC_SYNC N5V0_CFD=N5V0_CFD P3V3_QDC=P3V3_QDC P5V0_CFD=P5V0_CFD PLL_SPI_MOSI=PLL_SPI_MOSI SPI_SCLK_BUF=SPI_SCLK_BUF VREF_1.024V=VREF_1.024V VREF_2.048V=VREF_2.048V XDA22_A0=P3V3 XDA22_A1=GND
AFE/QDC7: designators end in G; ports ADC_CLK_DELAY=ADC_CLK_DELAY ADC_VREF=ADC_VREF DAC_SYNC=DAC_SYNC N5V0_CFD=N5V0_CFD P3V3_QDC=P3V3_QDC P5V0_CFD=P5V0_CFD PLL_SPI_MOSI=PLL_SPI_MOSI SPI_SCLK_BUF=SPI_SCLK_BUF VREF_1.024V=VREF_1.024V VREF_2.048V=VREF_2.048V XDA22_A0=GND XDA22_A1=P3V3
AFE/QDC8: designators end in H; ports ADC_CLK_DELAY=ADC_CLK_DELAY ADC_VREF=ADC_VREF DAC_SYNC=DAC_SYNC N5V0_CFD=N5V0_CFD P3V3_QDC=P3V3_QDC P5V0_CFD=P5V0_CFD PLL_SPI_MOSI=PLL_SPI_MOSI SPI_SCLK_BUF=SPI_SCLK_BUF VREF_1.024V=VREF_1.024V VREF_2.048V=VREF_2.048V XDA22_A0=P3V3 XDA22_A1=P3V3
AFE/QDC9: designators end in I; ports ADC_CLK_DELAY=ADC_CLK_DELAY ADC_VREF=ADC_VREF DAC_SYNC=DAC_SYNC N5V0_CFD=N5V0_CFD P3V3_QDC=P3V3_QDC P5V0_CFD=P5V0_CFD PLL_SPI_MOSI=PLL_SPI_MOSI SPI_SCLK_BUF=SPI_SCLK_BUF VREF_1.024V=VREF_1.024V VREF_2.048V=VREF_2.048V XDA22_A0=GND XDA22_A1=GND
AFE/QDC10: designators end in J; ports ADC_CLK_DELAY=ADC_CLK_DELAY ADC_VREF=ADC_VREF DAC_SYNC=DAC_SYNC N5V0_CFD=N5V0_CFD P3V3_QDC=P3V3_QDC P5V0_CFD=P5V0_CFD PLL_SPI_MOSI=PLL_SPI_MOSI SPI_SCLK_BUF=SPI_SCLK_BUF VREF_1.024V=VREF_1.024V VREF_2.048V=VREF_2.048V XDA22_A0=P3V3 XDA22_A1=GND
AFE/QDC11: designators end in K; ports ADC_CLK_DELAY=ADC_CLK_DELAY ADC_VREF=ADC_VREF DAC_SYNC=DAC_SYNC N5V0_CFD=N5V0_CFD P3V3_QDC=P3V3_QDC P5V0_CFD=P5V0_CFD PLL_SPI_MOSI=PLL_SPI_MOSI SPI_SCLK_BUF=SPI_SCLK_BUF VREF_1.024V=VREF_1.024V VREF_2.048V=VREF_2.048V XDA22_A0=GND XDA22_A1=P3V3
AFE/QDC12: designators end in L; ports ADC_CLK_DELAY=ADC_CLK_DELAY ADC_VREF=ADC_VREF DAC_SYNC=DAC_SYNC N5V0_CFD=N5V0_CFD P3V3_QDC=P3V3_QDC P5V0_CFD=P5V0_CFD PLL_SPI_MOSI=PLL_SPI_MOSI SPI_SCLK_BUF=SPI_SCLK_BUF VREF_1.024V=VREF_1.024V VREF_2.048V=VREF_2.048V XDA22_A0=P3V3 XDA22_A1=P3V3

### Notes on the sheet
- 2.048V
- 1.024V
- R45, R121, R122 Replace the symbol with an element from the CERN library.
- Project/Equipment
- Document
- Designer
- Drawn by
- Check.by
- Copyright WUT ISE 2024.
  This documentation describes Open Hardware and is licensed under the CERN OHL v.2. You may redistribute and modify this documentation under the terms of the CERN OHL v.2. (http://ohwr.org/CERNOHL). This documentation is distributed WITHOUT ANY EXPRESS OR IMPLIED WARRANTY, INCLUDING OF MERCHANTABILITY, SATISFACTORY QUALITY AND FITNESS FOR A PARTICULAR PURPOSE. Please see the CERN OHL v.2 for applicable conditions.
- Contact
- File
- Last Mod.
- Print Date
- Sheet
- Size
- A3
- of
- Rev
- (in symbol CTE3528-12_47UF_10V_20%_PANASONIC_TPG) +
- (in symbol R0805_300R_0.05%_0.125W_10PPM) 0.05%

### Library data of the parts
C54 C64 = CTE3528-12_47UF_10V_20%_PANASONIC_TPG: Polarised capacitor; Part Description: ESR 0R07 Solid Tantalum Chip Capacitor; Manufacturer Part Number: 10TPG47M; Voltage: 10V; Tolerance: ±20%; Part Number: CTE3528-12_47UF_10V_20%_PANASONIC_TPG; Component Kind: Standard; Component Type: Standard; Pin Count: 2; Value: 47uF; Status: None; Manufacturer: PANASONIC; Case: T; Mounted: Yes; Socket: No; SMD: Yes; Sense: No; ComponentHeight: 1.2mm; HelpURL: \\cern.ch\dfs\Applications\Altium\Datasheets\CTE_PANASONIC_TPG.pdf; Author: CERN DEM JLC; CreateDate: 01.09.2014; LatestRevisionDate: 01.09.2014
C90 C131 = CC0805_220NF_50V_10%_X7R: as C68 on sheet XC2C128; Part Number: CC0805_220NF_50V_10%_X7R; Component Kind: Standard; Component Type: Standard; Pin Count: 2; Value: 220nF; Status: Preferred; Manufacturer Part Number: CC0805_220NF_50V_10%_X7R; Case: 0805; Mounted: Yes; Socket: No; SMD: Yes; Sense: No; Manufacturer1 Example: MURATA; Manufacturer1 ComponentHeight: 1.35mm; HelpURL: \\cern.ch\dfs\Applications\Altium\Datasheets\CC0805_X7R_MURATA.pdf; Author: CERN DEM JLC; CreateDate: 03.12.2007; LatestRevisionDate: 03.12.2007
DA1 = OPA4350EA: Quad Operational Amplifier; Part Description: Quad, High-Speed, Single-Supply, Rail-to-Rail Operational Amplifiers MicroAmplifier Series; Manufacturer: TEXAS INSTRUMENTS; PressFit: No; Bonding: No; Part Number: OPA4350EA; Component Kind: Standard; Component Type: Standard; Device: OPA4350EA; PackageDescription: SOP, 0.635mm Pitch; 16 Pin, 3.9mm W X 4.895mm L X 1.75mm H body, IPC Medium Density; Manufacturer Part Number: OPA4350EA; Pin Count: 16; Case: SSOP16; Mounted: Yes; Socket: No; SMD: Yes; Sense: No; ComponentHeight: 1.75mm; Author: CERN DEM HF; HelpURL: \\cern.ch\dfs\Applications\Altium\Datasheets\OPA4350EA.pdf; CreateDate: 08.05.2024; LatestRevisionDate: 08.05.2024
DA17 = REF191ES: Precision Micropower, Low Dropout Voltage Reference; Part Description: 2.048V Precision Micropower, Low Dropout Voltage Reference, 5ppm/°C, −40°C to +85°C; Manufacturer: ANALOG DEVICES; PressFit: No; Bonding: No; Part Number: REF191ES; Component Kind: Standard; Component Type: Standard; Device: REF191ES; PackageDescription: SOIC 8, Pitch 1.27mm, Body 4x5mm, IPC Medium Density; Manufacturer Part Number: REF191ES; Pin Count: 8; Case: SOIC8; Mounted: Yes; Socket: No; SMD: Yes; Sense: No; ComponentHeight: 1.75mm; HelpURL: \\cern.ch\dfs\Applications\Altium\Datasheets\REF19x_Series.pdf; Author: CERN DEM HF; CreateDate: 17.05.2024; LatestRevisionDate: 17.05.2024
DA22 = DAC8554IPW: 16-Bit, Quad-Channel, Uultra-Low Glitch, Voltage Output Digital-to-Analog Converter; Manufacturer: TEXAS INSTRUMENTS; PressFit: No; Bonding: No; Part Number: DAC8554IPW; Component Kind: Standard; Component Type: Standard; Device: DAC8554IPW; PackageDescription: SOP, 0.65mm Pitch; 16 Pin, 4.40mm W X 5.00mm L X 1.10mm H body, IPC Medium Density; Part Description: 16-Bit, Quad-Channel, Uultra-Low Glitch, Voltage Output Digital-to-Analog Converter; Manufacturer Part Number: DAC8554IPW; Pin Count: 16; Case: TSSOP16; Mounted: Yes; Socket: No; SMD: Yes; Sense: No; ComponentHeight: 1.1mm; Author: CERN DEM HF; HelpURL: \\cern.ch\dfs\Applications\Altium\Datasheets\DAC8554.pdf; CreateDate: 07.05.2024; LatestRevisionDate: 07.05.2024
R31 R41 = R0805_100R_0.1%_0.1W_10PPM: Resistor - 0.1%; Part Description: Thin Film Chip Resistor; Manufacturer: GENERIC; Manufacturer1 Part Number: RN73C2A100RBTG; Power: 0.1W; TC: ±10ppm; PressFit: No; Part Number: R0805_100R_0.1%_0.1W_10PPM; Component Kind: Standard; Component Type: Standard; Pin Count: 2; Value: 100; Status: Not Recommended; Manufacturer Part Number: R0805_100R_0.1%_0.1W_10PPM; Case: 0805; Mounted: Yes; Sense: No; Socket: No; SMD: Yes; Manufacturer1 Example: TYCO HOLSWORTHY; Manufacturer1 ComponentHeight: 0.6mm; HelpURL: \\cern.ch\dfs\Applications\Altium\Datasheets\R0805_Tyco_RN73.pdf; Author: CERN DEM JLC; CreateDate: 03.12.2007; LatestRevisionDate: 13.03.2008
R34 = R0805_10K_0.1%_0.1W_10PPM: Resistor - 0.1%; Part Description: Thin Film Chip Resistor; Manufacturer: GENERIC; Manufacturer1 Part Number: RN73C2A10KBTG; Power: 0.1W; TC: ±10ppm; PressFit: No; Part Number: R0805_10K_0.1%_0.1W_10PPM; Component Kind: Standard; Component Type: Standard; Pin Count: 2; Value: 10k; Status: Not Recommended; Manufacturer Part Number: R0805_10K_0.1%_0.1W_10PPM; Case: 0805; Mounted: Yes; Sense: No; Socket: No; SMD: Yes; Manufacturer1 Example: TYCO HOLSWORTHY; Manufacturer1 ComponentHeight: 0.6mm; HelpURL: \\cern.ch\dfs\Applications\Altium\Datasheets\R0805_Tyco_RN73.pdf; Author: CERN DEM JLC; CreateDate: 03.12.2007; LatestRevisionDate: 13.03.2008
R39 R42 R44 R46 = R0805_300R_0.05%_0.125W_10PPM: Resistor - 0.05%; Part Description: Thin Film Chip Resistor; Manufacturer: GENERIC; Manufacturer1 Part Number: RG2012N-301-W; Power: 0.125W; TC: ±10ppm/°C; PressFit: No; Part Number: R0805_300R_0.05%_0.125W_10PPM; Component Kind: Standard; Component Type: Standard; Pin Count: 2; Value: 300; Status: Not Recommended; Tolerance: ±0.05%; Manufacturer Part Number: R0805_300R_0.05%_0.125W_10PPM; Case: 0805; Mounted: Yes; Sense: No; Socket: No; SMD: Yes; Manufacturer1 Example: SUSUMU; Manufacturer1 ComponentHeight: 0.5mm; HelpURL: \\cern.ch\dfs\Applications\Altium\Datasheets\R0805_SUSUMU_RG.pdf; Author: CERN DEM HF; CreateDate: 24.06.2024; LatestRevisionDate: 24.06.2024
R45x R122x = R0805_5K1_0.1%_0.1W_25PPM: Resistor - 0.1%; Part Description: Precision Surface Mount Resistor; Manufacturer: GENERIC; Manufacturer1 Part Number: PCF0805R-5K1BT1; Power: 0.1W; TC: ±25ppm/°C; PressFit: No; Part Number: R0805_5K1_0.1%_0.1W_25PPM; Component Kind: Standard; Component Type: Standard; Pin Count: 2; Value: 5k1; Status: Not Recommended; Manufacturer Part Number: R0805_5K1_0.1%_0.1W_25PPM; Case: 0805; Mounted: Yes; Sense: No; Socket: No; SMD: Yes; Manufacturer1 Example: TT ELECTRONICS; Manufacturer1 ComponentHeight: 0.5mm; HelpURL: \\cern.ch\dfs\Applications\Altium\Datasheets\R0805_TT ELECTRONICS_PCF.pdf; Author: CERN DEM JLC; CreateDate: 03.11.2010; LatestRevisionDate: 25.10.2018
R82 = R0805_10R_0.1%_0.1W_10PPM: Resistor - 0.1%; Part Description: Thin Film Chip Resistor; Manufacturer: GENERIC; Manufacturer1 Part Number: RN73C2A10RBTG; Power: 0.1W; TC: ±10ppm; PressFit: No; Part Number: R0805_10R_0.1%_0.1W_10PPM; Component Kind: Standard; Component Type: Standard; Pin Count: 2; Value: 10; Status: Not Recommended; Manufacturer Part Number: R0805_10R_0.1%_0.1W_10PPM; Case: 0805; Mounted: Yes; Sense: No; Socket: No; SMD: Yes; Manufacturer1 Example: TYCO HOLSWORTHY; Manufacturer1 ComponentHeight: 0.6mm; HelpURL: \\cern.ch\dfs\Applications\Altium\Datasheets\R0805_Tyco_RN73.pdf; Author: CERN DEM JLC; CreateDate: 03.12.2007; LatestRevisionDate: 13.03.2008
R121x = R0805_4K7_1%_0.125W_100PPM: Resistor - 1%; Part Description: General Purpose Thick Film Chip Resistor; Manufacturer: GENERIC; Manufacturer1 Part Number: NRC10F4701TRF; Power: 0.125W; TC: ±100ppm/°C; PressFit: No; Part Number: R0805_4K7_1%_0.125W_100PPM; Component Kind: Standard; Component Type: Standard; Pin Count: 2; Value: 4k7; Status: Preferred; Manufacturer Part Number: R0805_4K7_1%_0.125W_100PPM; Case: 0805; Mounted: Yes; Sense: No; Socket: No; SMD: Yes; Manufacturer1 Example: NIC COMPONENT; Manufacturer1 ComponentHeight: 0.6mm; HelpURL: \\cern.ch\dfs\Applications\Altium\Datasheets\R0805_NIC_NRC.pdf; Author: CERN DEM JLC; CreateDate: 03.12.2007; LatestRevisionDate: 13.03.2008
X2 = SAMTEC_DW-08-09-L-S-470: Connector 8 Male; Part Description: 8 Contacts, Pitch 2.54mm, Single Row Straight .Flex Stack, Flexible Board Stacker (Stacker Height = 11,938mm); Manufacturer: SAMTEC; PressFit: No; Part Number: SAMTEC_DW-08-09-L-S-470; Component Kind: Standard; Component Type: Standard; Pin Count: 8; Family: Header 8; Mounted: Yes; Socket: No; SMD: No; Sense: No; Status: None; Manufacturer Part Number: DW-08-09-L-S-470; ComponentHeight: 15.75mm; HelpURL: \\cern.ch\dfs\Applications\Altium\Datasheets\SAMTEC_DW.pdf; Author: CERN DEM HF; CreateDate: 06.06.2024; LatestRevisionDate: 06.06.2024

## Sheet ADC_PLL.SchDoc: FIT_PM12 board
size 420 x 297 mm; CheckedBy: G.Kasprowicz; Author: INR Moscow; CompanyName: WUT ISE; DrawnBy: M.Podgórski; Organization: WUT ISE; Address1: PW ISE; Address2: Nowowiejska 15/19 00-665 Warsaw; Address3: gkasprow@gmail.com; DocumentNumber: 6; Revision: 2; SheetNumber: 9; SheetTotal: 34; ModifiedBy: -; CheckedDate: -; Title2: ADC clocking; DivGrp: WUT ISE; Designer: INR RAS; ModifiedDate: -; ProjectName: Sensor Box
Used 12 times, as channels AFE/ADC_PLL1, AFE/ADC_PLL2, AFE/ADC_PLL3, AFE/ADC_PLL4, AFE/ADC_PLL5, AFE/ADC_PLL6, AFE/ADC_PLL7, AFE/ADC_PLL8, AFE/ADC_PLL9, AFE/ADC_PLL10, AFE/ADC_PLL11, AFE/ADC_PLL12. Parts and nets are listed once, with the designators drawn on the sheet.
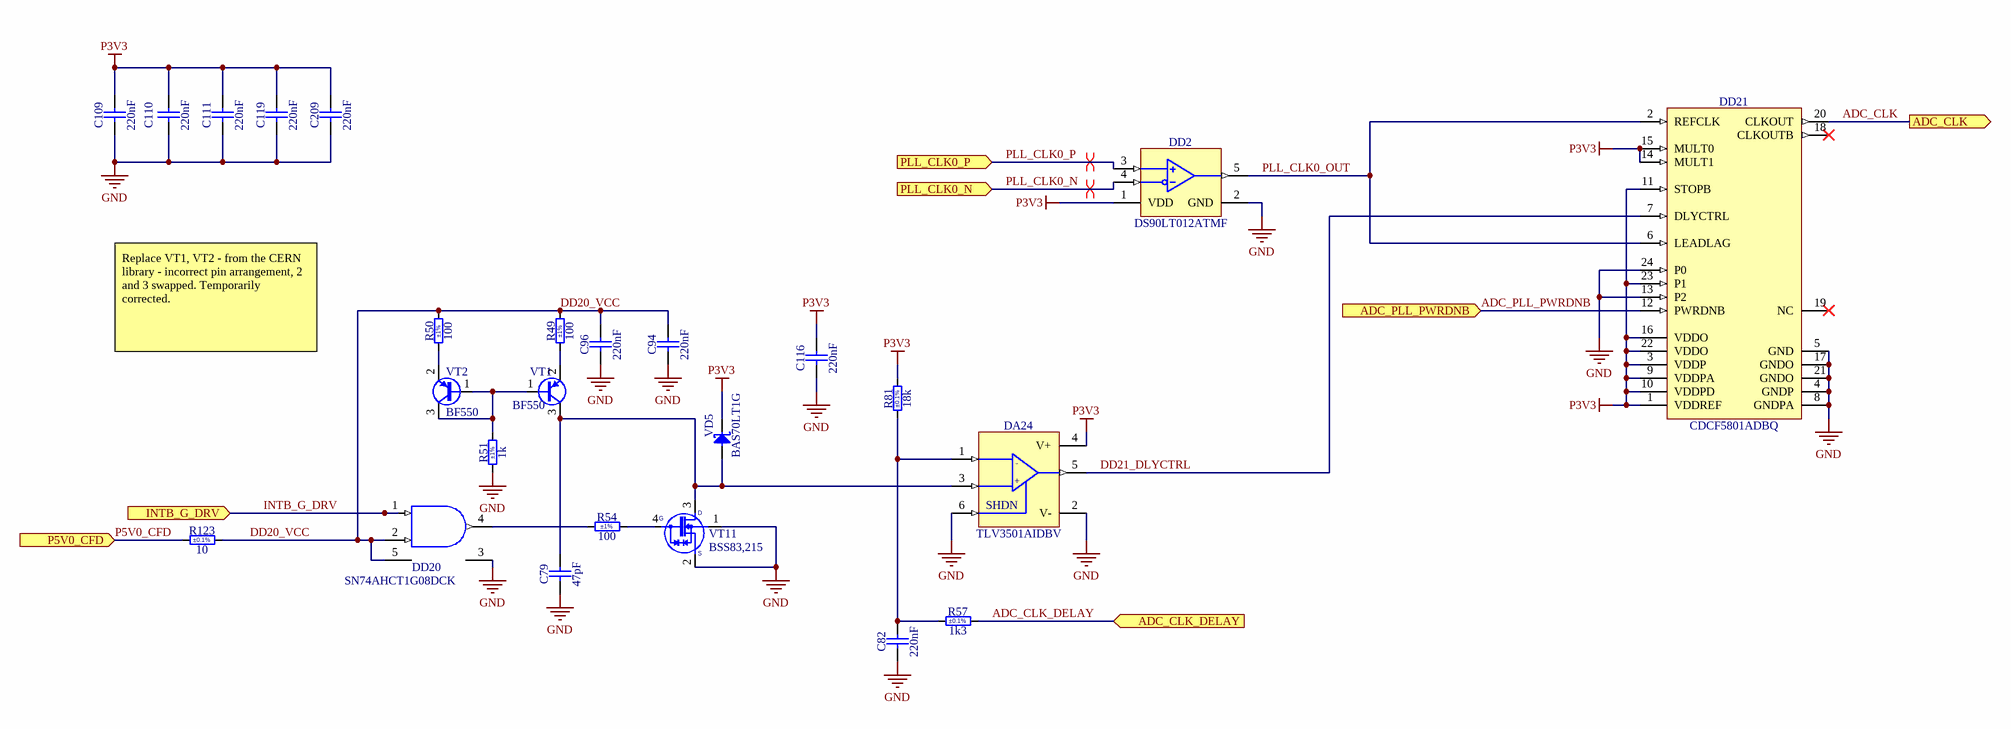
[diagram p32: ADC_PLL.SchDoc]

### Parts
C79  47pF  [CAPC2012X140N]
C82  220nF  [CAPC2012X135N]
C94  220nF  [CAPC2012X135N]
C96  220nF  [CAPC2012X135N]
C109  220nF  [CAPC2012X135N]
C110  220nF  [CAPC2012X135N]
C111  220nF  [CAPC2012X135N]
C116  220nF  [CAPC2012X135N]
C119  220nF  [CAPC2012X135N]
C209  220nF  [CAPC2012X135N]
DA24  TLV3501AIDBV  [SOT95P280X145-6N]
DD2  DS90LT012ATMF  [SOT95P280X145-5N]
DD20  SN74AHCT1G08DCK  [SOT65P210X110-5N]
DD21  CDCF5801ADBQ  [SOP63P600X175-24N]
R49  100  Tolerance: ±1%  [RESC2012X60N]
R50  100  Tolerance: ±1%  [RESC2012X60N]
R51  1k  Tolerance: ±1%  [RESC2012X60N]
R54  100  Tolerance: ±1%  [RESC1608X55N]
R57  1k3  Tolerance: ±0.1%  [RESC2012X60N]
R81  18k  Tolerance: ±0.1%  [RESC2012X60N]
R123  10  Tolerance: ±0.1%  [RESC2012X60N]
VD5  BAS70LT1G  [SOT95P240X110-3N]
VT1  BF550  [SOT95P230X110-3N]
VT2  BF550  [SOT95P230X110-3N]
VT11  BSS83,215  [SOT143N]

### Ports
ADC_CLK (out), ADC_CLK_DELAY (in), ADC_PLL_PWRDNB (in), INTB_G_DRV (in), P5V0_CFD (in), PLL_CLK0_N (in), PLL_CLK0_P (in)

### Nets
GND: C79.1 C82.1 C94.1 C96.1 C109.1 C110.1 C111.1 C116.1 C119.1 C209.1 DA24.2(V-) DA24.6(SHDN) DD2.2(GND) DD20.3(GND) DD21.4(GNDP) DD21.5(GND) DD21.8(GNDPA) DD21.13(P2) DD21.17(GNDO) DD21.21(GNDO) DD21.24(P0) R51.1 VT11.1(SUB) VT11.2(S)
P3V3: C109.2 C110.2 C111.2 C116.2 C119.2 C209.2 DA24.4(V+) DD2.1(VDD) DD21.1(VDDREF) DD21.3(VDDP) DD21.9(VDDPA) DD21.10(VDDPD) DD21.11(STOPB) DD21.14(MULT1) DD21.15(MULT0) DD21.16(VDDO) DD21.22(VDDO) DD21.23(P1) R81.2 VD5.3(C)
ADC_CLK: DD21.20(CLKOUT) ; port ADC_CLK
ADC_CLK_DELAY: R57.2 ; port ADC_CLK_DELAY
ADC_PLL_PWRDNB: DD21.12(PWRDNB) ; port ADC_PLL_PWRDNB
DD20_VCC: C94.2 C96.2 DD20.2(A) DD20.5(VCC) R49.2 R50.2 R123.2
DD21_DLYCTRL: DA24.5(OUT) DD21.7(DLYCTRL)
INTB_G_DRV: DD20.1(B) ; port INTB_G_DRV
P5V0_CFD: R123.1 ; port P5V0_CFD
PLL_CLK0_N: DD2.4(IN-) ; port PLL_CLK0_N
PLL_CLK0_OUT: DD2.5(TTLOUT) DD21.2(REFCLK) DD21.6(LEADLAG)
PLL_CLK0_P: DD2.3(IN+) ; port PLL_CLK0_P
NetC79_2: C79.2 DA24.3(+IN) VD5.1(A) VT1.3(E) VT11.3(D)
NetC82_2: C82.2 DA24.1(-IN) R57.1 R81.1
NetDD20_4: DD20.4(Y) R54.1
NetR49_1: R49.1 VT1.2(C)
NetR50_1: R50.1 VT2.2(C)
NetR51_2: R51.2 VT1.1(B) VT2.1(B) VT2.3(E)
NetR54_2: R54.2 VT11.4(G)

Not connected (* = marked no-connect by the designer): DD21 18(CLKOUTB)* 19(NC)*

### Channels
AFE/ADC_PLL1: designators end in A; ports ADC_CLK=ADC_CLK ADC_CLK_DELAY=ADC_CLK_DELAY ADC_PLL_PWRDNB=ADC_PLL_PWRDNB INTB_G_DRV=INTB_G_DRV P5V0_CFD=P5V0_CFD PLL_CLK0_N=PLL_CLK0_N PLL_CLK0_P=PLL_CLK0_P
AFE/ADC_PLL2: designators end in B; ports ADC_CLK=ADC_CLK ADC_CLK_DELAY=ADC_CLK_DELAY ADC_PLL_PWRDNB=ADC_PLL_PWRDNB INTB_G_DRV=INTB_G_DRV P5V0_CFD=P5V0_CFD PLL_CLK0_N=PLL_CLK0_N PLL_CLK0_P=PLL_CLK0_P
AFE/ADC_PLL3: designators end in C; ports ADC_CLK=ADC_CLK ADC_CLK_DELAY=ADC_CLK_DELAY ADC_PLL_PWRDNB=ADC_PLL_PWRDNB INTB_G_DRV=INTB_G_DRV P5V0_CFD=P5V0_CFD PLL_CLK0_N=PLL_CLK0_N PLL_CLK0_P=PLL_CLK0_P
AFE/ADC_PLL4: designators end in D; ports ADC_CLK=ADC_CLK ADC_CLK_DELAY=ADC_CLK_DELAY ADC_PLL_PWRDNB=ADC_PLL_PWRDNB INTB_G_DRV=INTB_G_DRV P5V0_CFD=P5V0_CFD PLL_CLK0_N=PLL_CLK0_N PLL_CLK0_P=PLL_CLK0_P
AFE/ADC_PLL5: designators end in E; ports ADC_CLK=ADC_CLK ADC_CLK_DELAY=ADC_CLK_DELAY ADC_PLL_PWRDNB=ADC_PLL_PWRDNB INTB_G_DRV=INTB_G_DRV P5V0_CFD=P5V0_CFD PLL_CLK0_N=PLL_CLK0_N PLL_CLK0_P=PLL_CLK0_P
AFE/ADC_PLL6: designators end in F; ports ADC_CLK=ADC_CLK ADC_CLK_DELAY=ADC_CLK_DELAY ADC_PLL_PWRDNB=ADC_PLL_PWRDNB INTB_G_DRV=INTB_G_DRV P5V0_CFD=P5V0_CFD PLL_CLK0_N=PLL_CLK0_N PLL_CLK0_P=PLL_CLK0_P
AFE/ADC_PLL7: designators end in G; ports ADC_CLK=ADC_CLK ADC_CLK_DELAY=ADC_CLK_DELAY ADC_PLL_PWRDNB=ADC_PLL_PWRDNB INTB_G_DRV=INTB_G_DRV P5V0_CFD=P5V0_CFD PLL_CLK0_N=PLL_CLK0_N PLL_CLK0_P=PLL_CLK0_P
AFE/ADC_PLL8: designators end in H; ports ADC_CLK=ADC_CLK ADC_CLK_DELAY=ADC_CLK_DELAY ADC_PLL_PWRDNB=ADC_PLL_PWRDNB INTB_G_DRV=INTB_G_DRV P5V0_CFD=P5V0_CFD PLL_CLK0_N=PLL_CLK0_N PLL_CLK0_P=PLL_CLK0_P
AFE/ADC_PLL9: designators end in I; ports ADC_CLK=ADC_CLK ADC_CLK_DELAY=ADC_CLK_DELAY ADC_PLL_PWRDNB=ADC_PLL_PWRDNB INTB_G_DRV=INTB_G_DRV P5V0_CFD=P5V0_CFD PLL_CLK0_N=PLL_CLK0_N PLL_CLK0_P=PLL_CLK0_P
AFE/ADC_PLL10: designators end in J; ports ADC_CLK=ADC_CLK ADC_CLK_DELAY=ADC_CLK_DELAY ADC_PLL_PWRDNB=ADC_PLL_PWRDNB INTB_G_DRV=INTB_G_DRV P5V0_CFD=P5V0_CFD PLL_CLK0_N=PLL_CLK0_N PLL_CLK0_P=PLL_CLK0_P
AFE/ADC_PLL11: designators end in K; ports ADC_CLK=ADC_CLK ADC_CLK_DELAY=ADC_CLK_DELAY ADC_PLL_PWRDNB=ADC_PLL_PWRDNB INTB_G_DRV=INTB_G_DRV P5V0_CFD=P5V0_CFD PLL_CLK0_N=PLL_CLK0_N PLL_CLK0_P=PLL_CLK0_P
AFE/ADC_PLL12: designators end in L; ports ADC_CLK=ADC_CLK ADC_CLK_DELAY=ADC_CLK_DELAY ADC_PLL_PWRDNB=ADC_PLL_PWRDNB INTB_G_DRV=INTB_G_DRV P5V0_CFD=P5V0_CFD PLL_CLK0_N=PLL_CLK0_N PLL_CLK0_P=PLL_CLK0_P

### Layout directives
differential pair: PLL_CLK0_N, PLL_CLK0_P

### Notes on the sheet
- Replace VT1, VT2 - from the CERN library - incorrect pin arrangement, 2 and 3 swapped. Temporarily corrected.
- Project/Equipment
- Document
- Designer
- Drawn by
- Check.by
- Copyright WUT ISE 2024.
  This documentation describes Open Hardware and is licensed under the CERN OHL v.2. You may redistribute and modify this documentation under the terms of the CERN OHL v.2. (http://ohwr.org/CERNOHL). This documentation is distributed WITHOUT ANY EXPRESS OR IMPLIED WARRANTY, INCLUDING OF MERCHANTABILITY, SATISFACTORY QUALITY AND FITNESS FOR A PARTICULAR PURPOSE. Please see the CERN OHL v.2 for applicable conditions.
- Contact
- File
- Last Mod.
- Print Date
- Sheet
- Size
- A3
- of
- Rev
- (in symbol TLV3501AIDBV) -; +

### Library data of the parts
C79 = CC0805_47pF_50V_2%_X8R: Non-polarised capacitor; Part Description: SMD Multilayer Chip Ceramic Capacitor (Automotive Grade); Manufacturer: KEMET; Manufacturer Part Number: C0805C470G5HACAUTO; Voltage: 50V; TC: X8R; Tolerance: ±2%; Part Number: CC0805_47pF_50V_2%_X8R; Component Kind: Standard; Component Type: Standard; Pin Count: 2; Value: 47pF; Status: Not Recommended; Case: 0805; Mounted: Yes; Socket: No; SMD: Yes; Sense: No; ComponentHeight: 1.4mm; HelpURL: \\cern.ch\dfs\Applications\Altium\Datasheets\CC0805_X8R_KEMET.pdf; Author: CERN DEM HF; CreateDate: 07.05.2024; LatestRevisionDate: 07.05.2024
C82 C94 C96 C109-C111 C116 C119 C209 = CC0805_220NF_50V_10%_X7R: as C68 on sheet XC2C128; Part Number: CC0805_220NF_50V_10%_X7R; Component Kind: Standard; Component Type: Standard; Pin Count: 2; Value: 220nF; Status: Preferred; Manufacturer Part Number: CC0805_220NF_50V_10%_X7R; Case: 0805; Mounted: Yes; Socket: No; SMD: Yes; Sense: No; Manufacturer1 Example: MURATA; Manufacturer1 ComponentHeight: 1.35mm; HelpURL: \\cern.ch\dfs\Applications\Altium\Datasheets\CC0805_X7R_MURATA.pdf; Author: CERN DEM JLC; CreateDate: 03.12.2007; LatestRevisionDate: 03.12.2007
DA24 = TLV3501AIDBV: Wideband, Fixed Gain, Video Buffer Amplifier With Disable; Part Description: 4.5-ns, Rail-to-Rail, High-Speed Comparator; Manufacturer: TEXAS INSTRUMENTS; PressFit: No; Bonding: No; Part Number: TLV3501AIDBV; Component Kind: Standard; Component Type: Standard; Device: TLV3501AIDBV; PackageDescription: SOT, 0.95mm Pitch; 6 Pin, 1.60mm W X 2.90mm L X 1.45mm H body, IPC Medium Density; Manufacturer Part Number: TLV3501AIDBV; Pin Count: 6; Case: SOT23-6; Mounted: Yes; Socket: No; SMD: Yes; Sense: No; ComponentHeight: 1.45mm; Author: CERN DEM HF; HelpURL: \\cern.ch\dfs\Applications\Altium\Datasheets\TLV3501.pdf; CreateDate: 17.05.2024; LatestRevisionDate: 17.05.2024
DD2 = DS90LT012ATMF: 3V LVDS Single CMOS Differential Line Receiver; Manufacturer: TEXAS INSTRUMENTS; PressFit: No; Bonding: No; Part Number: DS90LT012ATMF; Component Kind: Standard; Component Type: Standard; Device: DS90LT012ATMF; PackageDescription: SOT, 0.95mm Pitch; 5 Pin, 1.60mm W X 2.90mm L X 1.45mm H body, IPC Medium Density; Part Description: 3V LVDS Single CMOS Differential Line Receiver; Manufacturer Part Number: DS90LT012ATMF; Pin Count: 5; Case: SOT23-5; Mounted: Yes; Socket: No; SMD: Yes; Sense: No; ComponentHeight: 1.45mm; Author: CERN DEM HF; HelpURL: \\cern.ch\dfs\Applications\Altium\Datasheets\DS90LT012ATMF.pdf; CreateDate: 08.05.2024; LatestRevisionDate: 08.05.2024
DD20 = SN74AHCT1G08DCK: Single 2-Input AND Gate; Part Description: Single 2-Input Positive-AND Gate; Manufacturer: TEXAS INSTRUMENTS; PressFit: No; Bonding: No; Part Number: SN74AHCT1G08DCK; Component Kind: Standard; Component Type: Standard; Device: SN74AHCT1G08DCK; PackageDescription: SOT353, SC70-5, 0.65mm Pitch; 5 Pin, 1.25mm W X 2.00mm L X 1.10mm H body, IPC Medium Density; Manufacturer Part Number: SN74AHCT1G08DCK; Pin Count: 5; Case: SOT353; Mounted: Yes; Socket: No; SMD: Yes; Sense: No; ComponentHeight: 1.1mm; Author: CERN DEM HF; HelpURL: \\cern.ch\dfs\Applications\Altium\Datasheets\NC7SZ08.pdf; CreateDate: 17.05.2024; LatestRevisionDate: 17.05.2024
DD21 = CDCF5801ADBQ: Clock Multiplier with Delay Control and Phase Alignment; Manufacturer: TEXAS INSTRUMENTS; PressFit: No; Bonding: No; Part Number: CDCF5801ADBQ; Component Kind: Standard; Component Type: Standard; Device: CDCF5801ADBQ; PackageDescription: SOP, 0.635mm Pitch; 24 Pin, 3.90mm W X 8.65mm L X 1.75mm H Body, IPC Medium Density; Part Description: Clock Multiplier with Delay Control and Phase Alignment; Manufacturer Part Number: CDCF5801ADBQ; Pin Count: 24; Case: SSOP24; Mounted: Yes; Socket: No; SMD: Yes; Sense: No; ComponentHeight: 1.75mm; HelpURL: \\cern.ch\dfs\Applications\Altium\Datasheets\CDCF5801A.pdf; Author: CERN DEM HF; CreateDate: 07.05.2024; LatestRevisionDate: 07.05.2024
R49 R50 = R0805_100R_1%_0.125W_100PPM: Resistor - 1%; Part Description: General Purpose Thick Film Chip Resistor; Manufacturer: GENERIC; Manufacturer1 Part Number: NRC10F4700TRF; Power: 0.125W; TC: ±100ppm/°C; PressFit: No; Part Number: R0805_100R_1%_0.125W_100PPM; Component Kind: Standard; Component Type: Standard; Pin Count: 2; Value: 100; Status: Preferred; Manufacturer Part Number: R0805_100R_1%_0.125W_100PPM; Case: 0805; Mounted: Yes; Sense: No; Socket: No; SMD: Yes; Manufacturer1 Example: NIC COMPONENT; Manufacturer1 ComponentHeight: 0.6mm; HelpURL: \\cern.ch\dfs\Applications\Altium\Datasheets\R0805_NIC_NRC.pdf; Author: CERN DEM JLC; CreateDate: 03.12.2007; LatestRevisionDate: 13.03.2008
R51 = R0805_1K_1%_0.125W_100PPM: Resistor - 1%; Part Description: General Purpose Thick Film Chip Resistor; Manufacturer: GENERIC; Manufacturer1 Part Number: NRC10F1001TRF; Power: 0.125W; TC: ±100ppm/°C; PressFit: No; Part Number: R0805_1K_1%_0.125W_100PPM; Component Kind: Standard; Component Type: Standard; Pin Count: 2; Value: 1k; Status: Preferred; Manufacturer Part Number: R0805_1K_1%_0.125W_100PPM; Case: 0805; Mounted: Yes; Sense: No; Socket: No; SMD: Yes; Manufacturer1 Example: NIC COMPONENT; Manufacturer1 ComponentHeight: 0.6mm; HelpURL: \\cern.ch\dfs\Applications\Altium\Datasheets\R0805_NIC_NRC.pdf; Author: CERN DEM JLC; CreateDate: 03.12.2007; LatestRevisionDate: 13.03.2008
R54 = R0603_100R_1%_0.1W_100PPM: Resistor - 1%; Part Description: General Purpose Thick Film Chip Resistor; Manufacturer: GENERIC; Manufacturer1 Part Number: NRC06F4700TRF; Power: 0.1W; TC: ±100ppm/°C; PressFit: No; Part Number: R0603_100R_1%_0.1W_100PPM; Component Kind: Standard; Component Type: Standard; Pin Count: 2; Value: 100; Status: Preferred; Manufacturer Part Number: R0603_100R_1%_0.1W_100PPM; Case: 0603; Mounted: Yes; Sense: No; Socket: No; SMD: Yes; Manufacturer1 Example: NIC COMPONENT; Manufacturer1 ComponentHeight: 0.55mm; HelpURL: \\cern.ch\dfs\Applications\Altium\Datasheets\R0603_NIC_NRC.pdf; Author: CERN DEM JLC; CreateDate: 03.12.2007; LatestRevisionDate: 13.03.2008
R57 = R0805_1K3_0.1%_0.1W_10PPM: Resistor - 0.1%; Part Description: Thin Film Chip Resistor; Manufacturer: GENERIC; Manufacturer1 Part Number: RN73C2A1K3BTG; Power: 0.1W; TC: ±10ppm; PressFit: No; Part Number: R0805_1K3_0.1%_0.1W_10PPM; Component Kind: Standard; Component Type: Standard; Pin Count: 2; Value: 1k3; Status: Not Recommended; Manufacturer Part Number: R0805_1K3_0.1%_0.1W_10PPM; Case: 0805; Mounted: Yes; Sense: No; Socket: No; SMD: Yes; Manufacturer1 Example: TYCO HOLSWORTHY; Manufacturer1 ComponentHeight: 0.6mm; HelpURL: \\cern.ch\dfs\Applications\Altium\Datasheets\R0805_Tyco_RN73.pdf; Author: CERN DEM JLC; CreateDate: 03.12.2007; LatestRevisionDate: 13.03.2008
R81 = R0805_18K_0.1%_0.125W_10PPM: Resistor - 0.1%; Part Description: Thin Film Chip Resistor; Manufacturer: GENERIC; Manufacturer1 Part Number: ERA6ARB183V; Power: 0.125W; TC: ±10ppm; PressFit: No; Part Number: R0805_18K_0.1%_0.125W_10PPM; Component Kind: Standard; Component Type: Standard; Pin Count: 2; Value: 18k; Status: Not Recommended; Manufacturer Part Number: R0805_18K_0.1%_0.125W_10PPM; Case: 0805; Mounted: Yes; Sense: No; Socket: No; SMD: Yes; Manufacturer1 Example: PANASONIC; Manufacturer1 ComponentHeight: 0.6mm; HelpURL: \\cern.ch\dfs\Applications\Altium\Datasheets\R0805_PANASONIC_ERA.pdf; Author: CERN DEM HF; CreateDate: 17.05.2024; LatestRevisionDate: 17.05.2024
R123 = R0805_10R_0.1%_0.1W_10PPM: as R82 on sheet DAC8554; Part Number: R0805_10R_0.1%_0.1W_10PPM; Component Kind: Standard; Component Type: Standard; Pin Count: 2; Value: 10; Status: Not Recommended; Manufacturer Part Number: R0805_10R_0.1%_0.1W_10PPM; Case: 0805; Mounted: Yes; Sense: No; Socket: No; SMD: Yes; Manufacturer1 Example: TYCO HOLSWORTHY; Manufacturer1 ComponentHeight: 0.6mm; HelpURL: \\cern.ch\dfs\Applications\Altium\Datasheets\R0805_Tyco_RN73.pdf; Author: CERN DEM JLC; CreateDate: 03.12.2007; LatestRevisionDate: 13.03.2008
VD5 = BAS70LT1G: Diode Schottky  Anode Pin 1 Cathode Pin 3 (Pas de pin 2); Part Description: Schottky Barrier Diode; Manufacturer: ON SEMICONDUCTOR; Manufacturer Part Number: BAS70L; Voltage: 70V; Power: 70mA; PressFit: No; Bonding: No; Part Number: BAS70LT1G; Component Kind: Standard; Component Type: Standard; Device: BAS70LT1G; PackageDescription: SOT, 0.95mm Pitch; 3 Pin, 1.30mm W X 2.90mm L X 1.10mm H body, IPC Medium Density; Pin Count: 3; Case: SOT23-3; Mounted: Yes; Socket: No; SMD: Yes; Sense: No; ComponentHeight: 1.1mm; HelpURL: \\cern.ch\dfs\Applications\Altium\Datasheets\BAS70LT1G.pdf; Author: CERN DEM JLC; CreateDate: 11.09.2018; LatestRevisionDate: 24.05.2022
VT1 VT2 = BF550: PNP Transistor; Part Description: 40V 25mA PNP Medium Frequency Transistor; Manufacturer: NXP SEMICONDUCTORS; PressFit: No; Bonding: No; Part Number: BF550; Component Kind: Standard; Component Type: Standard; Device: BF550; PackageDescription: SOT23, 0.95mm Pitch; 3 Pin, 1.30mm W X 2.90mm L X 1.10mm H body, IPC Medium Density; Manufacturer Part Number: BF550; Pin Count: 3; Case: SOT23-3; Mounted: Yes; Socket: No; SMD: Yes; Sense: No; ComponentHeight: 1.1mm; HelpURL: \\cern.ch\dfs\Applications\Altium\Datasheets\BF550.pdf; Author: CERN DEM HF; CreateDate: 06.05.2024; LatestRevisionDate: 06.05.2024
VT11 = BSS83,215: 10V, 50 mA N-Channel Enhancement Switching Transistor; Part Description: 10V, 50mA, N-Channel Enhancement Switching Transistor; Manufacturer: NXP SEMICONDUCTORS; PressFit: No; Bonding: No; Part Number: BSS83,215; Component Kind: Standard; Component Type: Standard; Device: BSS83,215; PackageDescription: SOT143, 4-Leads, Body 3.0x2.6mm (max), Pitch 1.92mm, IPC Medium Density; Status: Obsolete; Manufacturer Part Number: BSS83,215; Pin Count: 4; Case: SOT143; Mounted: Yes; Socket: No; SMD: Yes; Sense: No; ComponentHeight: 1.3mm; HelpURL: \\cern.ch\dfs\Applications\Altium\Datasheets\BSS83,215.pdf; Author: CERN DEM JLC; CreateDate: 01.07.2014; LatestRevisionDate: 17.05.2016